# EAGLE design Master_node (EAGLE 9.6.2)
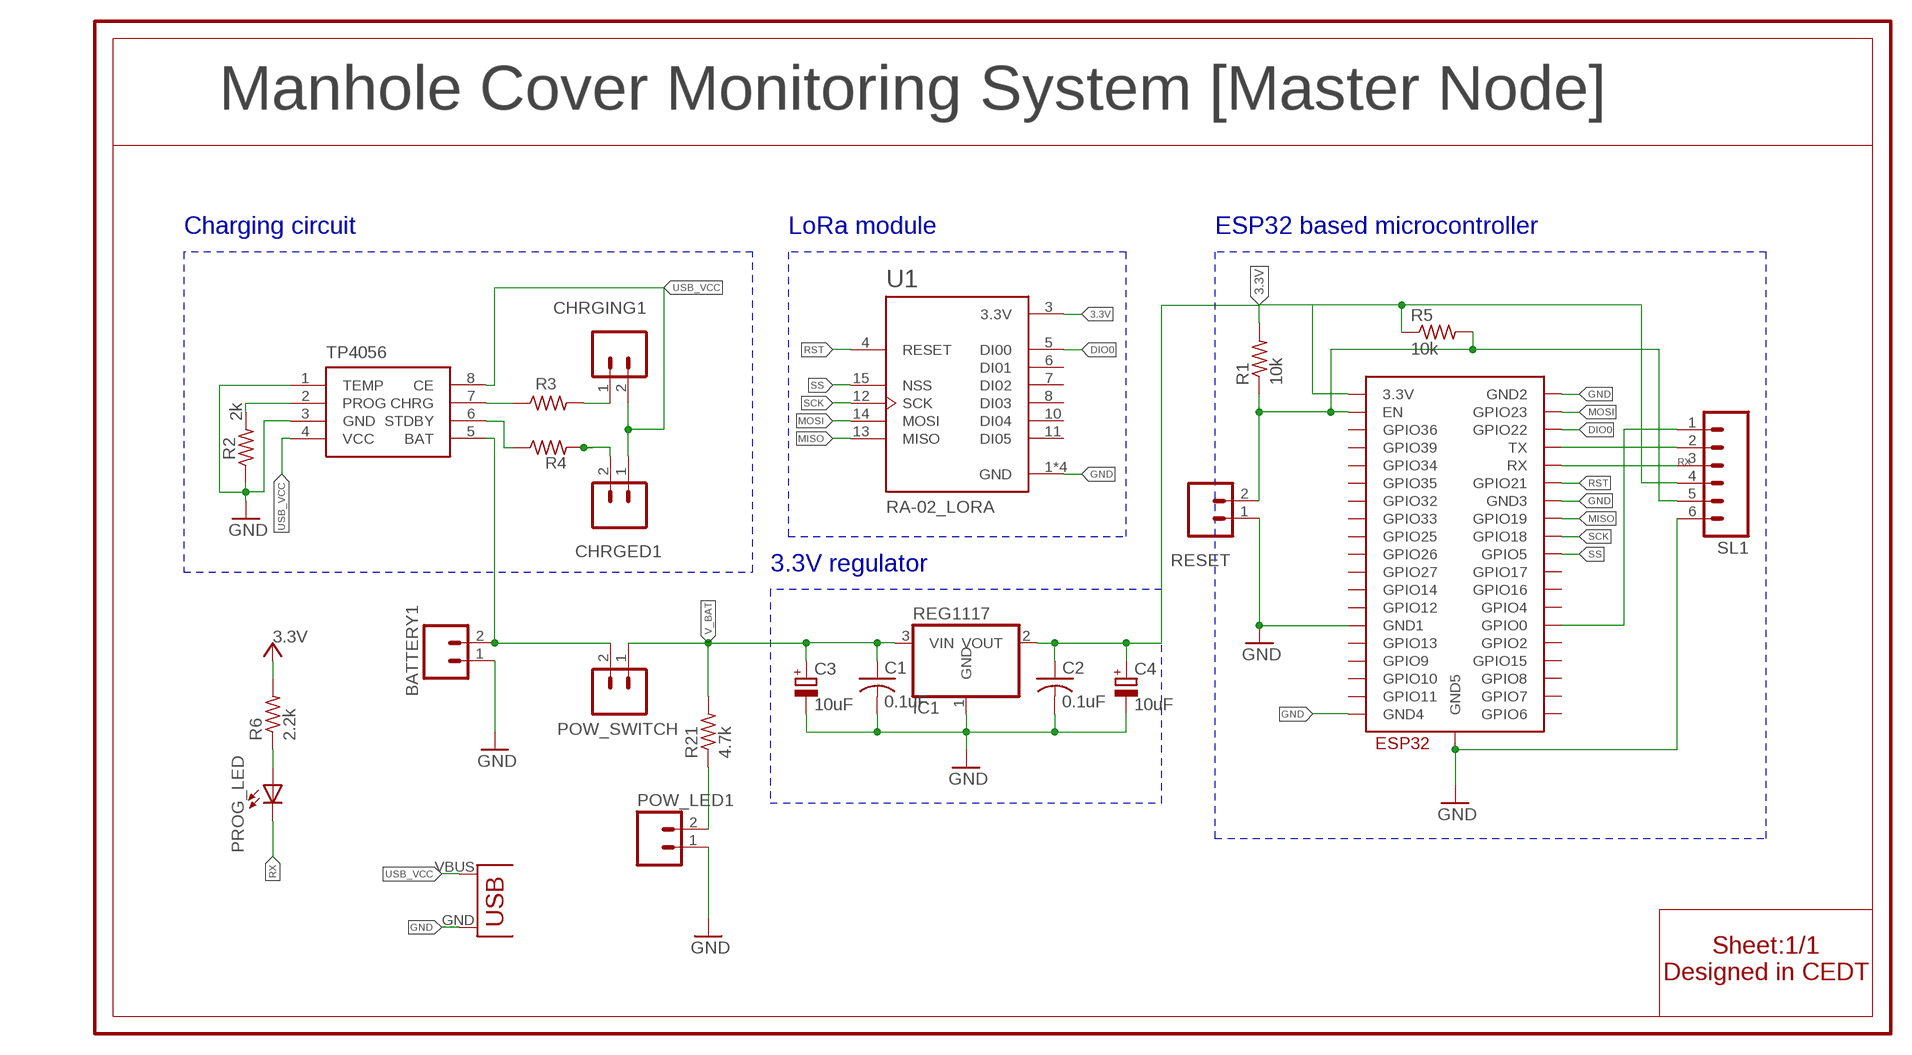
[diagram p0: schematic, sheet 1]

## Parts
BATTERY1  M02  [02P]
C1  0.1uF  CAP0805  [C0805]
C2  0.1uF  CAP0805  [C0805]
C3  10uF  C-POL_TANTALUM-1411(3528-METRIC)  [CAPMP3528X210N]
C4  10uF  C-POL_TANTALUM-1411(3528-METRIC)  [CAPMP3528X210N]
CHRGED1  M02  [02P]
CHRGING1  M02  [02P]
IC1  REG1117  [SOT223]
POW_LED1  M02  [02P]
POW_SWITCH  M02  [02P]
PROG_LED  LED0603  [CHIPLED_0603]
R1  10k  RESISTOR0207/7  [0207/7]
R2  2k  RESISTOR0207/7  [0207/7]
R3  470  RESISTOR0207/7  [0207/7]
R4  470  RESISTOR0207/7  [0207/7]
R5  10k  RESISTOR0805  [R0805]
R6  2.2k  RESISTOR0805  [R0805]
R21  4.7k  R-US_0207/10  [0207/10]
RESET  M02  [02P]
SL1  M06  [06P]
TP4056  TP4056  [SOP-8]
U1  RA-02_LORA  [MODULE_RA-02_LORA]
U$1  ESP32-WROOM  [ESP32-WROOM]
U$3  USB(POWER)  [USB(POWER)]

## Nets
3.3V: C2.1 C4.1(+) IC1.2(VOUT) R1.2 R5.1 R6.2 SL1.4 U1.3(3.3V) U$1.3V3(3.3V) ; supply symbol labelled VCC
BAT: BATTERY1.2 POW_SWITCH.2 TP4056.5(BAT)
DIO0: U1.5(DI00) U$1.IO22(GPIO22)
GND: BATTERY1.1 C1.2 C2.2 C3.2(-) C4.2(-) IC1.1(GND) POW_LED1.1 R2.1 RESET.1 SL1.6 TP4056.1(TEMP) TP4056.3(GND) U1.1(GND) U1.2(GND) U1.9(GND) U1.16(GND) U$1.GND1 U$1.GND2 U$1.GND3 U$1.GND4 U$1.GND5 U$3.GND
MISO: U1.13(MISO) U$1.IO19(GPIO19)
MOSI: U1.14(MOSI) U$1.IO23(GPIO23)
N$1: R1.1 R5.2 RESET.2 SL1.5 U$1.EN
N$2: SL1.2 U$1.TX
N$4: SL1.1 U$1.IO0(GPIO0)
N$5: R2.2 TP4056.2(PROG)
N$6: CHRGING1.1 R3.2
N$7: PROG_LED.A R6.1
N$9: CHRGED1.2 R4.2
N$11: R3.1 TP4056.7(CHRG)
N$12: R4.1 TP4056.6(STDBY)
N$13: POW_LED1.2 R21.1
RST: U1.4(RESET) U$1.IO21(GPIO21)
RX: PROG_LED.C SL1.3 U$1.RX
SCK: U1.12(SCK) U$1.IO18(GPIO18)
SS: U1.15(NSS) U$1.IO5(GPIO5)
USB_VCC: CHRGED1.1 CHRGING1.2 TP4056.4(VCC) TP4056.8(CE) U$3.VBUS(VCC)
V_BAT: C1.1 C3.1(+) IC1.3(VIN) POW_SWITCH.1 R21.2
Unconnected: U1.6(DI01) U1.7(DI02) U1.8(DI03) U1.10(DI04) U1.11(DI05) U$1.CLK(GPIO6) U$1.CMD(GPIO11) U$1.IO2(GPIO2) U$1.IO4(GPIO4) U$1.IO12(GPIO12) U$1.IO13(GPIO13) U$1.IO14(GPIO14) U$1.IO15(GPIO15) U$1.IO16(GPIO16) U$1.IO17(GPIO17) U$1.IO25(GPIO25) U$1.IO26(GPIO26) U$1.IO27(GPIO27) U$1.IO32(GPIO32) U$1.IO33(GPIO33) U$1.IO34(GPIO34) U$1.IO35(GPIO35) U$1.SD0(GPIO7) U$1.SD1(GPIO8) U$1.SD2(GPIO9) U$1.SD3(GPIO10) U$1.SENSOR_VN(GPIO39) U$1.SENSOR_VP(GPIO36)

## Notes on the sheet
- Manhole Cover Monitoring System [Master Node]
- Charging circuit | LoRa module | ESP32 based microcontroller
- 3.3V regulator
- Sheet:1/1
  Designed in CEDT

## Library data of the parts
BATTERY1 CHRGED1 CHRGING1 POW_LED1 POW_SWITCH RESET = CEDT_JANUARY_2015_v6:M02: AMP QUICK CONNECTOR
C1 C2 = CEDT_JANUARY_2015_v6:CAP
C3 C4 = Capacitor:C-POL: Capacitor Polarised - Generic; CATEGORY: Capacitor
IC1 = CEDT_JANUARY_2015_v6:REG1117: 800mA and 1A Low Dropout (LDO) Positive Regulator 1.8V, 2.5V, 2.85V, 3.3V, 5V, and Adj
PROG_LED = CEDT_JANUARY_2015_v6:LED
R1 R5 R6 = CEDT_JANUARY_2015_v6:RESISTOR
R2-R4 = CEDT_JANUARY_2015_v5:RESISTOR; OC_FARNELL: unknown
R21 = rcl:R-US_: RESISTOR, American symbol; SPICEPREFIX: R
SL1 = con-amp-quick:M06: AMP QUICK CONNECTOR; OC_FARNELL: unknown; OC_NEWARK: unknown
TP4056 = TP4056:TP4056
U1 = RA-02_LORA:RA-02_LORA: Ra-02 LoRa RF M5Stack Platform Evaluation Expansion Board Check availability <https://pricing.snapeda.com/parts/Ra-02%20LoRa/AI-Thinker/view-part?ref=eda>; AVAILABILITY: In Stock; DESCRIPTION: Ra-02 LoRa RF M5Stack Platform Evaluation Expansion Board; MF: AI-Thinker; MP: Ra-02 LoRa; PACKAGE: None; PRICE: None; PURCHASE-URL: https://pricing.snapeda.com/search/part/Ra-02 LoRa/?ref=eda
U$1 = ESP32_WROOM32:ESP32-WROOM
U$3 = CEDT_JANUARY_2015_v6:USB(POWER)

## Net classes
0 default: width 0.406 mm
1 POWER: width 0.61 mm, drill 0.7 mm, clearance 0.25 mm

## Board
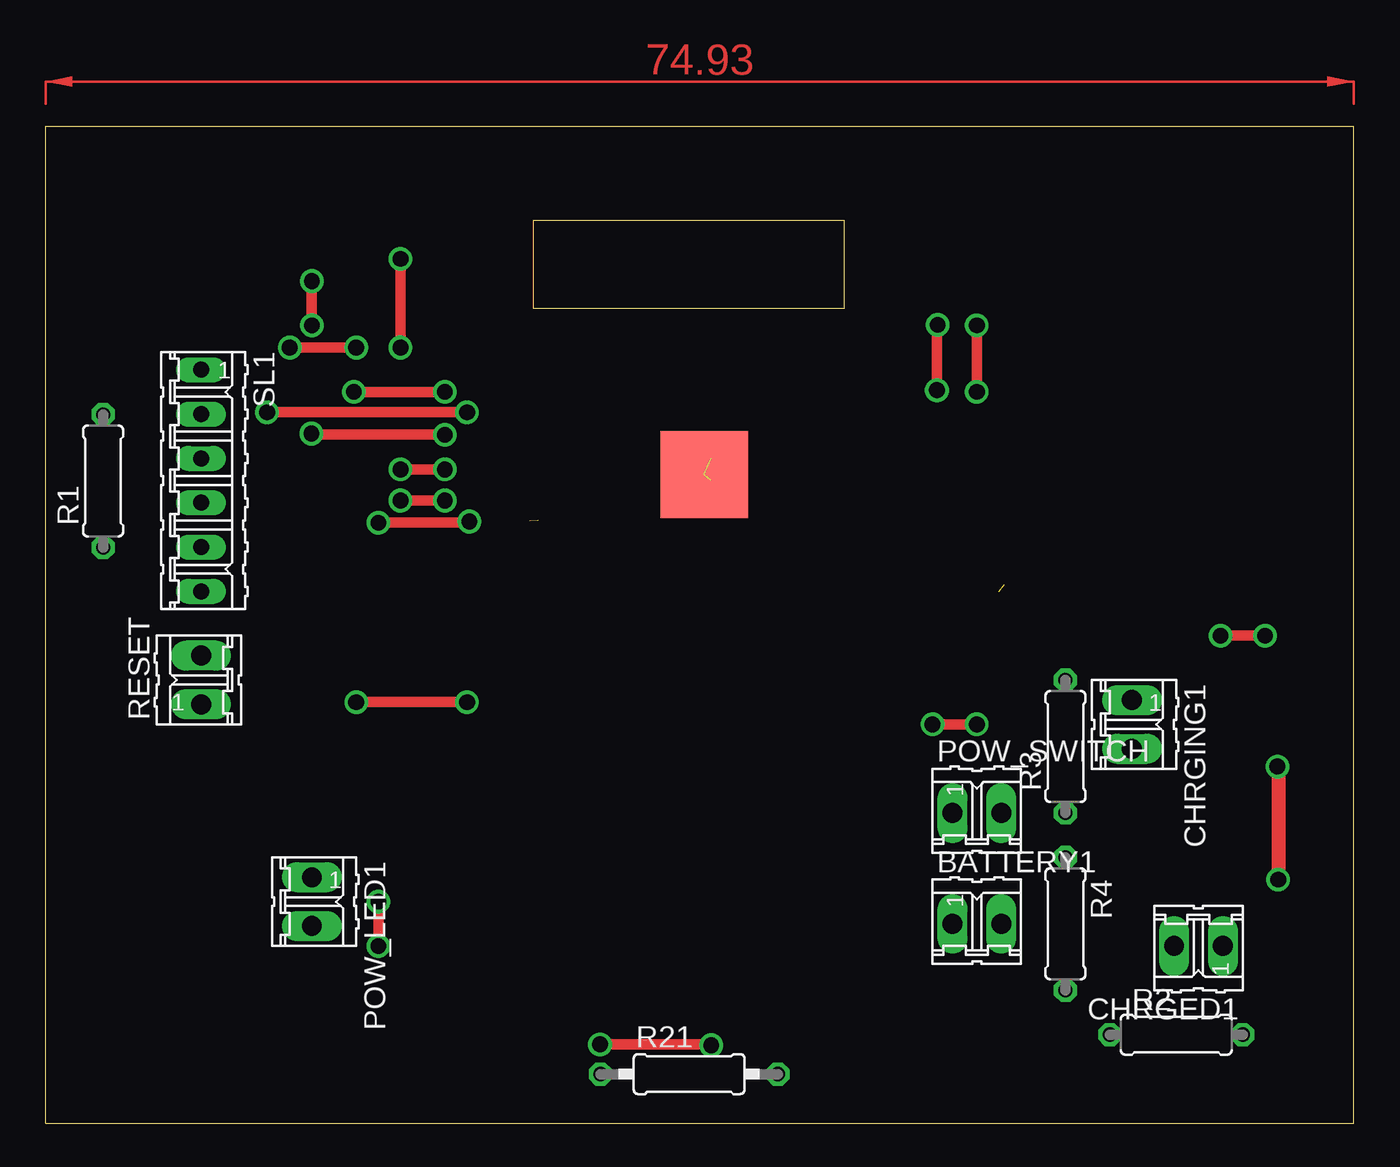
[diagram p1: board, top side]
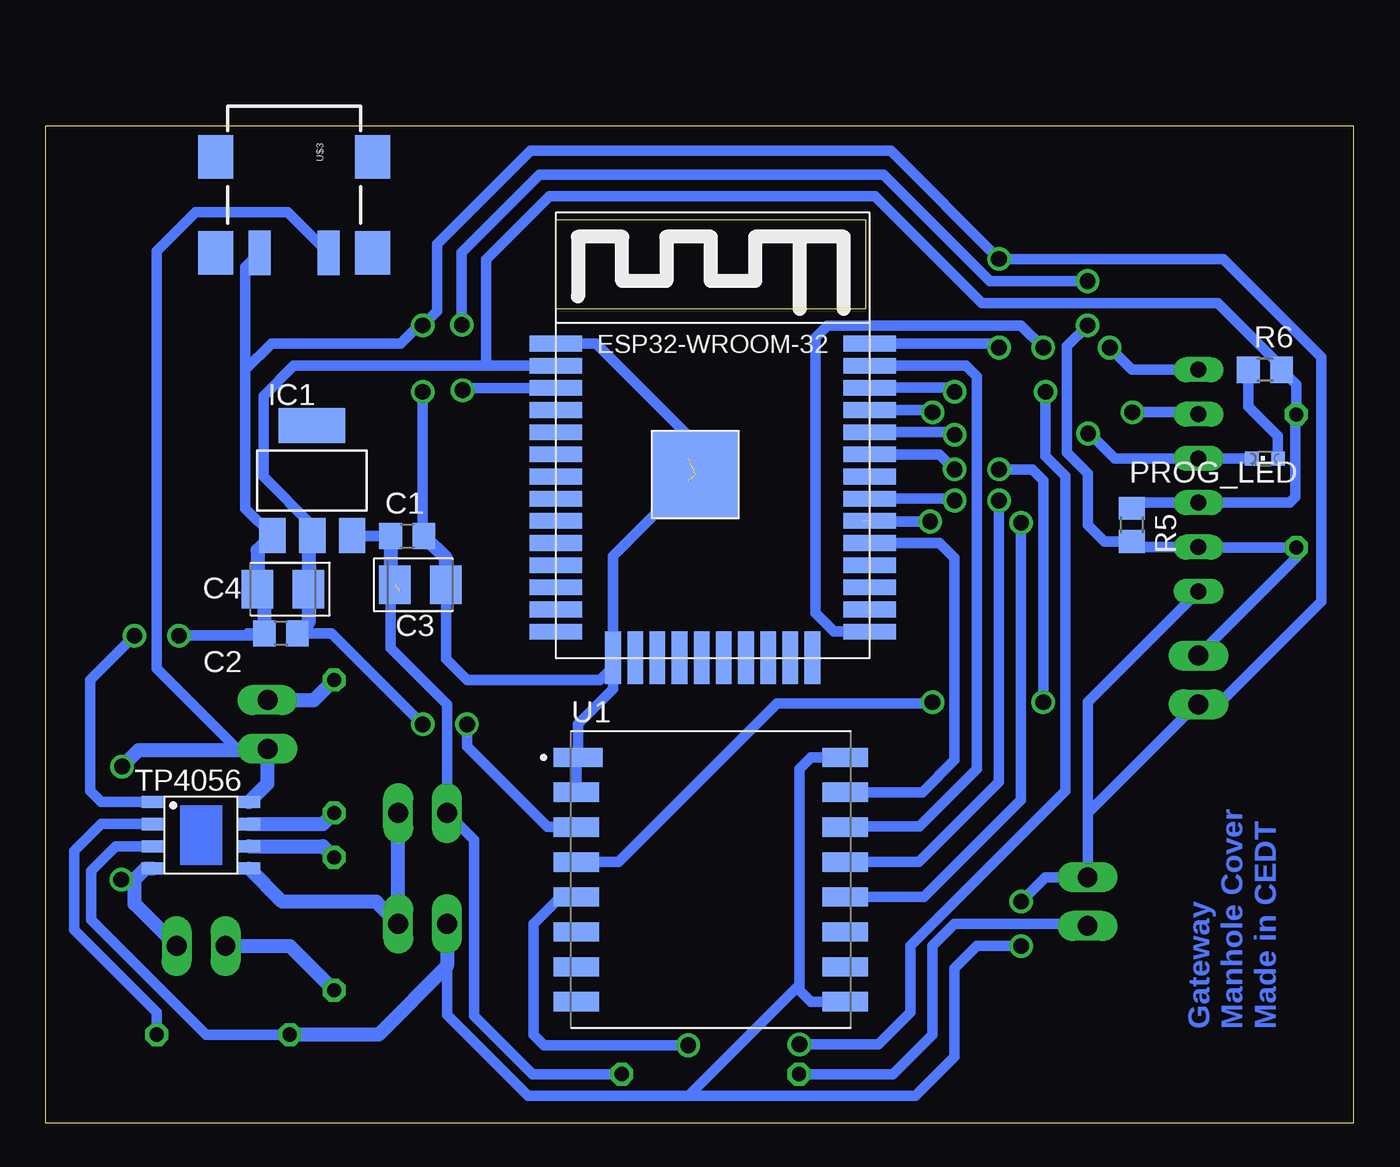
[diagram p2: board, bottom side, seen from below]

Size 74.93 x 57.15 mm. Coordinates in mm from the lower left corner, seen from the top.
Outline: 0,0 0,57.15 74.93,57.15 74.93,0 0,0
Outline: 27.94,51.75 45.72,51.75 45.72,46.67 27.94,46.67 27.94,51.75
Copper layers (1*16): Top 0.035mm / dielectric 1.5mm / Bottom 0.035mm
Design rules "default": minimum track width 6mil, minimum drill 0.35mm, track to track 6mil, track to pad 6mil, pad to pad 6mil, via to via 6mil, smd to smd 6mil, copper to edge 40mil, drill to drill 6mil, minimum pad ring 10mil, minimum via ring 8mil, stop-mask expansion 4mil, vias tented up to drill 0mil, thermal gap 10mil

### Footprints (pad centres in the part's own frame; a part is rotated, then mirrored left to right if it is on the bottom)
02P = drill 1.143 long: 1 -1.397,0; 2 1.397,0
C0805 = smd 1.3 x 1.5: 1 -0.95,0; 2 0.95,0
CAPMP3528X210N = smd 1.796 x 2.204: 1 -1.46,0; 2 1.46,0
SOT223 = smd 1.499 x 2.007: 1 -2.261,-3.15; 2 0.025,-3.15; 3 2.311,-3.15 | smd 3.81 x 2.007: 4 0,3.15
CHIPLED_0603 = smd 0.8 x 0.8: A 0,-0.75; C 0,0.75
0207/7 = drill 0.813 octagon: 1 -3.81,0; 2 3.81,0
R0805 = smd 1.3 x 1.5: 1 -0.95,0; 2 0.95,0
0207/10 = drill 0.813 octagon: 1 -5.08,0; 2 5.08,0
06P = drill 0.914 long: 1 -6.35,0; 2 -3.81,0; 3 -1.27,0; 4 1.27,0; 5 3.81,0; 6 6.35,0
SOP-8 = smd 1.3 x 0.7: 1 -2.75,1.905; 2 -2.75,0.635; 3 -2.75,-0.635; 4 -2.75,-1.905; 5 2.75,-1.905; 6 2.75,-0.635; 7 2.75,0.635; 8 2.75,1.905
MODULE_RA-02_LORA = smd 2.8 x 1.1: 1 -7.6,7 | smd 2.6 x 1.1: 2 -7.7,5; 3 -7.7,3; 4 -7.7,1; 5 -7.7,-1; 6 -7.7,-3; 7 -7.7,-5; 8 -7.7,-7; 9 7.7,-7; 10 7.7,-5; 11 7.7,-3; 12 7.7,-1; 13 7.7,1; 14 7.7,3; 15 7.7,5; 16 7.7,7
ESP32-WROOM = smd 3 x 0.9: 3V3 0,16.74; EN 0,15.47; GND1 0,18.01; GND3 18,18.01; IO0 18,1.5; IO4 18,2.77; IO5 18,6.58; IO12 0,1.5; IO14 0,2.77; IO16 18,4.04; IO17 18,5.31; IO18 18,7.85; IO19 18,9.12; IO21 18,11.66; IO22 18,15.47; IO23 18,16.74; IO25 0,6.58; IO26 0,5.31; IO27 0,4.04; IO32 0,9.12; IO33 0,7.85; IO34 0,11.66; IO35 0,10.39; NC 18,10.39; RX 18,12.93; SENSOR_VN 0,12.93; SENSOR_VP 0,14.2; TX 18,14.2 | smd 0.9 x 3: CLK 9.635,0; CMD 8.365,0; GND2 3.285,0; IO2 14.715,0; IO13 4.555,0; IO15 13.445,0; SD0 10.905,0; SD1 12.175,0; SD2 5.825,0; SD3 7.095,0 | smd 5 x 5: GND4 8,10.5 | smd 5 x 5 bottom: GND5 8,10.5
USB(POWER) = smd 2.54 x 1.27: GND 2.5,-1.981; VBUS 2.5,1.981 | smd 2.5 x 2: GND@1 -3,-4.5; GND@2 -3,4.5; GND@3 2.5,4.5; GND@4 2.5,-4.5

### Placement (x,y rotation side)
BATTERY1  53.34,11.43 0 top
C1  54.23,33.66 0 bottom
C2  61.47,28.07 180 bottom
C3  53.47,30.86 0 bottom
C4  61.34,30.61 180 bottom
CHRGED1  66.04,10.16 180 top
CHRGING1  62.23,22.86 270 top
IC1  59.69,36.83 0 bottom
POW_LED1  15.24,12.7 270 top
POW_SWITCH  53.34,17.78 0 top
PROG_LED  5.08,38.1 90 bottom
R1  3.28,36.8 90 top
R2  64.77,5.08 0 top
R3  58.42,21.59 90 top
R4  58.42,11.43 270 top
R5  12.7,34.29 270 bottom
R6  5.08,43.18 0 bottom
R21  36.86,2.82 0 top
RESET  8.89,25.4 90 top
SL1  8.89,36.83 270 top
TP4056  66.04,16.51 0 bottom
U1  36.83,13.97 0 bottom
U$1  45.72,26.67 0 bottom
U$3  60.71,52.37 270 bottom

### Tracks (layer width: path | path; a pad name or v marks a point on that pad's centre or on a via)
3.3V  (via drill 0.9)
  Top 0.61: v53.34,22.86 v50.8,22.86
  Bottom 0.61: R5.1 12.38,35.56 SL1.4 3.66,35.56 3.33,35.89 3.33,40.56 R1.2 3.28,42.33 R6.2 4.13,43.35 7.77,46.99 21.29,46.99 27.43,53.14 46.08,53.14 49.72,49.49 49.72,43.41 U$1.3V3 60.73,43.41 62.46,41.68 62.46,37.06 59.66,34.27 IC1.2 | v53.34,22.86 58.55,28.07 C2.1 | v50.8,22.86 50.8,21.59 46.18,16.97 U1.3
  Bottom 0.813: IC1.2 59.88,33.46 C4.1 59.88,28.7 C2.1
BAT
  Bottom 0.813: TP4056.5 61.38,12.7 56.01,12.7 BATTERY1.2 POW_SWITCH.2
DIO0  (via drill 0.9)
  Top 0.61: v17.65,41.91 v22.86,41.91 | v31.75,4.52 38.08,4.52 v38.12,4.47
  Bottom 0.61: 44.44,12.95 44.45,12.97 U1.5 45.45,12.97 46.99,11.43 46.99,5.08 46.38,4.47 v38.12,4.47 | 31.88,4.52 v31.75,4.52 27.23,4.52 25.4,6.35 25.4,10.16 16.51,19.05 16.51,37.08 17.65,38.23 v17.65,41.91 | v22.86,41.91 23.11,42.16 27.7,42.16 U$1.IO22
GND  (via drill 0.9)  (3 unrouted)
  Top 0.61: v19.05,12.7 v19.05,10.16 | v20.32,44.45 v20.32,49.53 | v69.85,27.94 v67.31,27.94 | v53.34,45.72 v53.34,41.91
  Bottom 0.61: U1.16 31.1,20.97 31.75,20.32 31.75,7.92 | 31.75,7.92 31.75,7.62 31.1,6.97 U1.9 | U1.2 44.53,20.87 U1.1 44.43,22.88 42.44,24.88 U$1.GND2 | 15.24,17.78 POW_LED1.1 17.65,14.1 v19.05,12.7 | 15.24,17.78 15.24,24.13 SL1.6 | 15.24,17.78 9.02,24 RESET.1 7.75,24 1.85,29.9 1.85,43.92 7.47,49.53 v20.32,49.53 26.52,55.73 47.17,55.73 52.53,50.37 52.53,46.53 v53.34,45.72 53.57,45.72 54.61,44.68 62,44.68 63.5,43.18 | U$1.GND2 42.44,26.14 43.18,25.4 50.8,25.4 52.01,26.61 C3.2 | U$1.GND2 42.44,32.49 38.1,36.83 | 38.1,38.1 37.47,38.73 43.41,44.68 U$1.GND1 | 63.37,28.07 C2.2 62.55,27.94 v67.31,27.94 | v19.05,10.16 21.59,10.16 22.86,8.89 22.86,3.81 25.09,1.57 38.1,1.57 | 38.1,1.57 47.3,1.57 51.94,6.22 BATTERY1.1 | 31.75,7.92 38.1,1.57 | U$1.GND3 20.55,44.68 v20.32,44.45 | U$3.GND 63.5,49.06 63.5,43.18 | IC1.1 63.5,35.23 63.5,43.18 | TP4056.1 71.75,18.41 72.39,19.05 72.39,25.4 v69.85,27.94 | TP4056.3 70.92,15.88 72.34,14.45 72.34,11.66 65.76,5.08 59.69,5.08 | v53.34,41.91 53.34,33.72 C1.2
  Bottom 0.813: IC1.1 62.8,32.83 C4.2 62.42,30.22 C2.2 | C1.2 52.01,32.38 52.01,32.13 C3.2 | BATTERY1.1 51.94,9.02 55.88,5.08 59.69,5.08 R2.1
MISO  (via drill 0.9)
  Top 0.61: v22.86,35.69 v20.32,35.69
  Bottom 0.61: U1.13 24.91,14.97 20.32,19.56 v20.32,35.69 | 22.96,35.79 U$1.IO19
  Bottom 0.813: v22.86,35.69 22.96,35.79
MOSI
  Bottom 0.61: 29.08,17.02 24.89,17.02 21.59,20.32 21.59,42.8 22.2,43.41 U$1.IO23
  Bottom 0.813: U1.14 29.08,17.02
N$1  (via drill 0.9)
  Top 0.61: v51.1,45.74 51.05,45.7 v51.05,42.01 | v15.24,48.26 v15.24,45.72
  Bottom 0.61: RESET.2 3.28,32.41 R1.1 8.87,32.99 SL1.5 12.38,33.02 R5.2 14.29,33.34 15.24,34.29 15.24,37.24 16.43,38.43 16.43,44.53 v15.24,45.72 | U$1.EN 50.93,42.14 v51.05,42.01 | v51.1,45.74 51.1,49.89 46.63,54.36 26.95,54.36 20.85,48.26 v15.24,48.26
N$2  (via drill 0.9)
  Top 0.61: v24.13,40.74 v12.68,40.74
  Bottom 0.61: v12.68,40.74 8.99,40.74 SL1.2 | v24.13,40.74 24.26,40.87 U$1.TX
N$4  (via drill 0.9)
  Top 0.61: v17.78,44.45 v13.97,44.45
  Bottom 0.61: U$1.IO0 29.77,28.17 30.84,29.23 30.84,45.03 30.15,45.72 19.05,45.72 v17.78,44.45 | v13.97,44.45 12.7,43.18 SL1.1
N$5
  Bottom 0.61: R2.2 68.58,6.35 73.3,11.07 73.3,15.6 71.75,17.14 TP4056.2
N$6
  Bottom 0.813: CHRGING1.1 59.56,24.26 R3.2
N$7
  Bottom 0.61: PROG_LED.A 4.33,39.37 6.03,41.07 R6.1
N$9
  Bottom 0.813: CHRGED1.2 60.96,10.16 R4.2
N$11
  Bottom 0.813: TP4056.7 59.05,17.14 R3.1
N$12
  Bottom 0.813: TP4056.6 59.05,15.88 R4.1
N$13
  Bottom 0.61: R21.1 26.39,2.82 24.13,5.08 24.13,10.16 22.86,11.43 15.37,11.43 POW_LED1.2
RST  (via drill 0.9)
  Top 0.61: v22.86,37.47 v20.32,37.47 | v24.13,24.13 v17.78,24.13
  Bottom 0.61: v17.78,24.13 17.78,36.83 18.41,37.47 v20.32,37.47 | v22.86,37.47 23.73,38.33 U$1.IO21 | 44.55,14.99 U1.4 42.12,14.97 33.03,24.05 24.56,24.05 24.49,24.13 v24.13,24.13
RX  (via drill 0.9)
  Top 0.61: v22.86,39.45 22.84,39.47 15.27,39.47 v15.21,39.52
  Bottom 0.61: v15.21,39.52 15.11,39.52 13.69,38.1 SL1.3 PROG_LED.C | v22.86,39.45 23.01,39.6 U$1.RX
SCK  (via drill 0.9)  (1 unrouted)
  Top 0.61: v19.05,34.42 24.26,34.42
  Top 0.813: 24.26,34.42 v24.26,34.48
  Bottom 0.61: U1.12 24.62,12.97 19.05,18.54 v19.05,34.42 | v24.26,34.48 28.13,34.48
  Bottom 0.813: 28.13,34.48 28.19,34.54
SS
  Bottom 0.61: U1.15 24.72,18.97 22.86,20.83 22.86,32.38 23.73,33.25 U$1.IO5
USB_VCC  (via drill 0.9)
  Top 0.813: v70.56,20.45 70.61,20.4 v70.61,13.97
  Bottom 0.61: CHRGING1.2 62.26,21.49 64.01,21.49 68.58,26.06 68.58,49.99 66.34,52.22 61.07,52.22 U$3.VBUS
  Bottom 0.813: CHRGED1.1 69.85,12.57 69.85,13.97 | 69.85,13.97 69.22,14.61 TP4056.4 | TP4056.8 62.23,19.48 CHRGING1.2 62.31,21.39 69.62,21.39 v70.56,20.45 | 69.85,13.97 v70.61,13.97
V_BAT  (1 unrouted)
  Bottom 0.61: R21.2 47.04,2.82 50.39,6.17 50.39,16.23 POW_SWITCH.1 51.94,24 55.18,27.24 55.18,31.05 | C1.1 57.35,33.66 IC1.3
  Bottom 0.813: C1.1 55.18,31.05 54.61,30.48
(copper drawn outside any net)
  shapes: Top area x2

### Text on the board
Bottom: Gateway / Manhole Cover / Made in CEDT